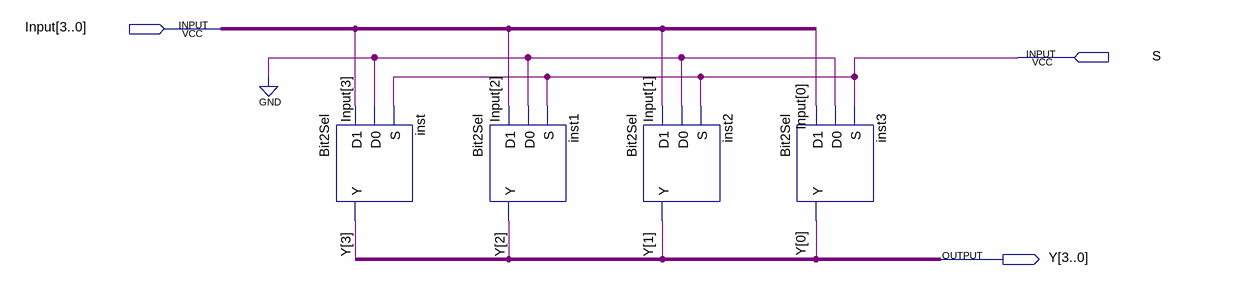
[diagram p0: schematic sheet]
// Quartus schematic Selector.bdf as structural Verilog: 4 symbols, 3 pins
module Selector (
  input  [3:0] Input,
  input  S,
  output [3:0] Y
);

  Bit2Sel inst (.D1(Input[3]), .D0(1'b0), .S(S), .Y(Y[3]));
  Bit2Sel inst1 (.D1(Input[2]), .D0(1'b0), .S(S), .Y(Y[2]));
  Bit2Sel inst2 (.D1(Input[1]), .D0(1'b0), .S(S), .Y(Y[1]));
  Bit2Sel inst3 (.D1(Input[0]), .D0(1'b0), .S(S), .Y(Y[0]));
endmodule
